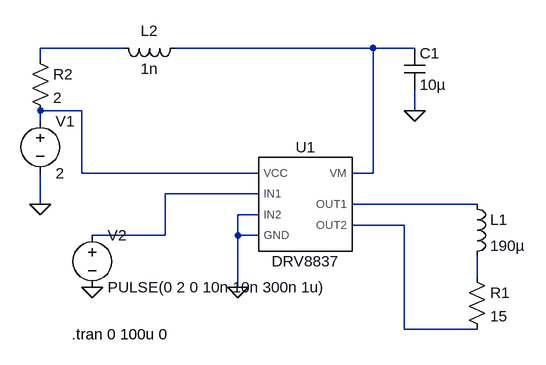
[diagram p0: schematic power-circuit.asc]
power-circuit.asc, the LTspice schematic file:
Version 4
SHEET 1 880 680
WIRE -48 -64 -176 -64
WIRE 336 -64 32 -64
WIRE 400 -64 336 -64
WIRE -176 -48 -176 -64
WIRE -112 32 -176 32
WIRE 400 32 400 0
WIRE -176 48 -176 32
WIRE -112 128 -112 32
WIRE 160 128 -112 128
WIRE 336 128 336 -64
WIRE 336 128 304 128
WIRE 160 160 16 160
WIRE -176 176 -176 128
WIRE 496 176 304 176
WIRE 160 192 128 192
WIRE 384 208 304 208
WIRE 16 224 16 160
WIRE 16 224 -96 224
WIRE 128 224 128 192
WIRE 160 224 128 224
WIRE 496 288 496 256
WIRE 128 304 128 224
WIRE 384 368 384 208
WIRE 496 368 384 368
FLAG 128 304 0
FLAG -176 176 0
FLAG -96 304 0
FLAG 400 32 0
SYMBOL DRV8837 224 176 R0
SYMATTR InstName U1
SYMBOL ind 480 160 R0
SYMATTR InstName L1
SYMATTR Value 190µ
SYMATTR SpiceLine Rser=5
SYMBOL res 480 272 R0
SYMATTR InstName R1
SYMATTR Value 15
SYMBOL voltage -176 32 R0
WINDOW 123 0 0 Left 2
WINDOW 39 0 0 Left 2
SYMATTR InstName V1
SYMATTR Value 2
SYMBOL ind 48 -80 R90
WINDOW 0 5 56 VBottom 2
WINDOW 3 32 56 VTop 2
SYMATTR InstName L2
SYMATTR Value 1n
SYMBOL voltage -96 208 R0
WINDOW 123 0 0 Left 2
WINDOW 39 0 0 Left 2
SYMATTR InstName V2
SYMATTR Value PULSE(0 2 0 10n 10n 300n 1u)
SYMBOL res -192 -64 R0
SYMATTR InstName R2
SYMATTR Value 2
SYMBOL cap 384 -64 R0
SYMATTR InstName C1
SYMATTR Value 10µ
TEXT -128 376 Left 2 !.tran 0 100u 0

The netlist it stands for:
* power-circuit.asc
XU1 N004 0 N003 N002 0 N005 N006 DRV8837  ; pins IN1 IN2 VCC VM GND OUT1 OUT2
L1 N005 N007 190µ Rser=5
R1 N007 N006 15
V1 N003 0 2
L2 N002 N001 1n
V2 N004 0 PULSE(0 2 0 10n 10n 300n 1u)
R2 N001 N003 2
C1 N002 0 10µ
.tran 0 100u 0
.lib .\drv8837.lib
.backanno
.end